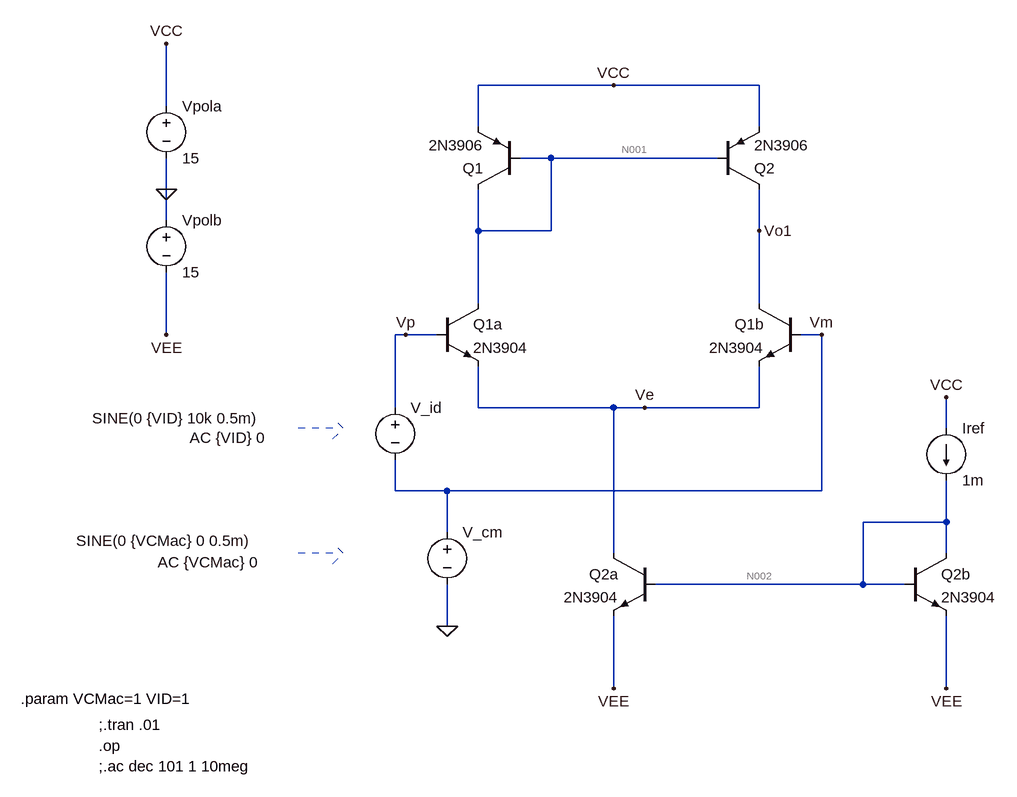
[diagram p0: schematic laboE1_2.asc]
laboE1_2.asc, the LTspice schematic file:
Version 4
SHEET 1 2404 1432
WIRE 288 -16 80 -16
WIRE 512 -16 288 -16
WIRE -400 16 -400 -80
WIRE 80 48 80 -16
WIRE 512 48 512 -16
WIRE 192 96 144 96
WIRE 448 96 192 96
WIRE -400 144 -400 96
WIRE -400 192 -400 144
WIRE 80 208 80 144
WIRE 192 208 192 96
WIRE 192 208 80 208
WIRE 512 208 512 144
WIRE 80 320 80 208
WIRE 512 320 512 208
WIRE -400 368 -400 272
WIRE -32 368 -48 368
WIRE 16 368 -32 368
WIRE 608 368 576 368
WIRE -48 480 -48 368
WIRE 80 480 80 416
WIRE 288 480 80 480
WIRE 336 480 288 480
WIRE 512 480 512 416
WIRE 512 480 336 480
WIRE 800 512 800 464
WIRE -48 608 -48 560
WIRE 32 608 -48 608
WIRE 608 608 608 368
WIRE 608 608 32 608
WIRE 800 656 800 592
WIRE 800 656 672 656
WIRE 32 672 32 608
WIRE 288 704 288 480
WIRE 800 704 800 656
WIRE 672 752 672 656
WIRE 672 752 352 752
WIRE 736 752 672 752
WIRE 32 816 32 752
WIRE 288 912 288 800
WIRE 800 912 800 800
FLAG 288 -16 VCC
FLAG -400 -80 VCC
FLAG -400 368 VEE
FLAG -400 144 0
FLAG 288 912 VEE
FLAG 512 208 Vo1
FLAG 800 464 VCC
FLAG 608 368 Vm
FLAG -32 368 Vp
FLAG 800 912 VEE
FLAG 32 816 0
FLAG 336 480 Ve
SYMBOL npn 16 320 R0
SYMATTR InstName Q1a
SYMATTR Value 2N3904
SYMBOL npn 576 320 M0
SYMATTR InstName Q1b
SYMATTR Value 2N3904
SYMBOL voltage -400 0 R0
WINDOW 123 0 0 Left 0
WINDOW 39 0 0 Left 0
SYMATTR InstName Vpola
SYMATTR Value 15
SYMBOL voltage -400 176 R0
WINDOW 123 0 0 Left 0
WINDOW 39 0 0 Left 0
SYMATTR InstName Vpolb
SYMATTR Value 15
SYMBOL npn 352 704 M0
SYMATTR InstName Q2a
SYMATTR Value 2N3904
SYMBOL npn 736 704 R0
SYMATTR InstName Q2b
SYMATTR Value 2N3904
SYMBOL voltage 32 656 R0
WINDOW 123 -445 62 Left 2
WINDOW 39 0 0 Left 0
WINDOW 3 -571 29 Left 2
SYMATTR Value2 AC {VCMac} 0
SYMATTR Value SINE(0 {VCMac} 0 0.5m)
SYMATTR InstName V_cm
SYMBOL current 800 512 R0
SYMATTR InstName Iref
SYMATTR Value 1m
SYMBOL voltage -48 464 R0
WINDOW 123 -316 62 Left 2
WINDOW 39 0 0 Left 0
WINDOW 3 -466 32 Left 2
SYMATTR Value2 AC {VID} 0
SYMATTR Value SINE(0 {VID} 10k 0.5m)
SYMATTR InstName V_id
SYMBOL pnp 144 144 R180
SYMATTR InstName Q1
SYMATTR Value 2N3906
SYMBOL pnp 448 144 M180
SYMATTR InstName Q2
SYMATTR Value 2N3906
TEXT -504 1000 Left 2 !.op
TEXT -504 1032 Left 2 !;.ac dec 101 1 10meg
TEXT -504 968 Left 2 !;.tran .01
TEXT -624 928 Left 2 !.param VCMac=1 VID=1
LINE Normal -144 512 -208 512 2
LINE Normal -144 704 -208 704 2
LINE Normal -144 704 -144 704 2
LINE Normal -128 704 -144 688 2
LINE Normal -144 720 -128 704 2
LINE Normal -128 512 -144 496 2
LINE Normal -144 528 -128 512 2

The netlist it stands for:
* laboE1_2.asc
Q1a N001 Vp Ve 0 2N3904
Q1b Vo1 Vm Ve 0 2N3904
Vpola VCC 0 15
Vpolb 0 VEE 15
Q2a Ve N002 VEE 0 2N3904
Q2b N002 N002 VEE 0 2N3904
V_cm Vm 0 SINE(0 {VCMac} 0 0.5m) AC {VCMac} 0
Iref VCC N002 1m
V_id Vp Vm SINE(0 {VID} 10k 0.5m) AC {VID} 0
Q1 N001 N001 VCC 0 2N3906
Q2 Vo1 N001 VCC 0 2N3906
.model NPN NPN
.model PNP PNP
.lib standard.bjt
.op
;.ac dec 101 1 10meg
;.tran .01
.param VCMac=1 VID=1
.backanno
.end

* Results of the author's LTspice run, read from the files saved beside the schematic
* Operating Point:
*   V(n001) = 14.36 V
*   V(vp) = 0 V
*   V(ve) = -637 mV
*   V(vo1) = 13.83 V
*   V(vm) = 0 V
*   V(vcc) = 15 V
*   V(vee) = -15 V
*   V(n002) = -14.34 V
*   Ic(Q1a) = 564.1 µA
*   Ib(Q1a) = 1.646 µA
*   Ie(Q1a) = -565.8 µA
*   Ic(Q1b) = 561.5 µA
*   Ib(Q1b) = 1.646 µA
*   Ie(Q1b) = -563.2 µA
*   Ic(Q2a) = 1.129 mA
*   Ib(Q2a) = 3.318 µA
*   Ie(Q2a) = -1.132 mA
*   Ic(Q2b) = 993.4 µA
*   Ib(Q2b) = 3.319 µA
*   Ie(Q2b) = -996.7 µA
*   Ic(Q1) = -558.5 µA
*   Ib(Q1) = -2.797 µA
*   Ie(Q1) = 561.3 µA
*   Ic(Q2) = -561.5 µA
*   Ib(Q2) = -2.797 µA
*   Ie(Q2) = 564.3 µA
*   I(Iref) = 1 mA
*   I(Vpola) = -2.126 mA
*   I(Vpolb) = -2.129 mA
*   I(V_cm) = -3.293 µA
*   I(V_id) = -1.646 µA
* From the log:
*   Semiconductor Device Operating Points:
*                           --- Bipolar Transistors ---
*   Name:       q1a         q1b         q2a         q2b         q1
*   Model:    2n3904      2n3904      2n3904      2n3904      2n3906
*   Ib:       1.65e-06    1.65e-06    3.32e-06    3.32e-06   -2.80e-06
*   Ic:       5.64e-04    5.62e-04    1.13e-03    9.93e-04   -5.59e-04
*   Vbe:      6.37e-01    6.37e-01    6.55e-01    6.55e-01   -6.40e-01
*   Vbc:     -1.44e+01   -1.38e+01   -1.37e+01    0.00e+00    0.00e+00
*   Vce:      1.50e+01    1.45e+01    1.44e+01    6.55e-01   -6.40e-01
*   BetaDC:   3.43e+02    3.41e+02    3.40e+02    2.99e+02    2.00e+02
*   Gm:       2.18e-02    2.17e-02    4.35e-02    3.83e-02    2.16e-02
*   Rpi:      1.57e+04    1.57e+04    7.80e+03    7.79e+03    9.25e+03
*   Rx:       2.00e+01    2.00e+01    2.00e+01    2.00e+01    2.00e+01
*   Ro:       2.03e+05    2.03e+05    1.01e+05    1.01e+05    1.79e+05
*   Cbe:      2.00e-11    2.00e-11    2.78e-11    2.59e-11    2.31e-11
*   Cbc:      1.48e-12    1.50e-12    1.51e-12    4.00e-12    4.50e-12
*   Cjs:      0.00e+00    0.00e+00    0.00e+00    0.00e+00    0.00e+00
*   BetaAC:   3.42e+02    3.41e+02    3.39e+02    2.98e+02    1.99e+02
*   Cbx:      0.00e+00    0.00e+00    0.00e+00    0.00e+00    0.00e+00
*   Ft:       1.61e+08    1.61e+08    2.37e+08    2.04e+08    1.25e+08
*   Name:       q2
*   Model:    2n3906
*   Ib:      -2.80e-06
*   Ic:      -5.62e-04
*   Vbe:     -6.40e-01
*   Vbc:      5.33e-01
*   Vce:     -1.17e+00
*   BetaDC:   2.01e+02
*   Gm:       2.17e-02
*   Rpi:      9.25e+03
*   Rx:       2.00e+01
*   Ro:       1.79e+05
*   Cbe:      2.31e-11
*   Cbc:      3.77e-12
*   Cjs:      0.00e+00
*   BetaAC:   2.00e+02
*   Cbx:      0.00e+00
*   Ft:       1.28e+08
*   Operating Bias Point Solution:
*   V(n001)                    14.3598   voltage
*   V(vp)                            0   voltage
*   V(ve)                    -0.636963   voltage
*   V(vo1)                     13.8269   voltage
*   V(vm)                            0   voltage
*   V(vcc)                          15   voltage
*   V(vee)                         -15   voltage
*   V(n002)                   -14.3448   voltage
*   Ic(Q1a)                0.000564137   device_current
*   Ib(Q1a)                1.64635e-06   device_current
*   Ie(Q1a)               -0.000565783   device_current
*   Ic(Q1b)                0.000561513   device_current
*   Ib(Q1b)                1.64636e-06   device_current
*   Ie(Q1b)                -0.00056316   device_current
*   Ic(Q2a)                 0.00112894   device_current
*   Ib(Q2a)                3.31769e-06   device_current
*   Ie(Q2a)                -0.00113226   device_current
*   Ic(Q2b)                0.000993363   device_current
*   Ib(Q2b)                3.31943e-06   device_current
*   Ie(Q2b)               -0.000996682   device_current
*   Ic(Q1)                -0.000558543   device_current
*   Ib(Q1)                -2.79662e-06   device_current
*   Ie(Q1)                  0.00056134   device_current
*   Ic(Q2)                -0.000561513   device_current
*   Ib(Q2)                -2.79658e-06   device_current
*   Ie(Q2)                  0.00056431   device_current
*   I(Iref)                      0.001   device_current
*   I(Vpola)               -0.00212565   device_current
*   I(Vpolb)               -0.00212894   device_current
*   I(V_cm)               -3.29271e-06   device_current
*   I(V_id)               -1.64635e-06   device_current